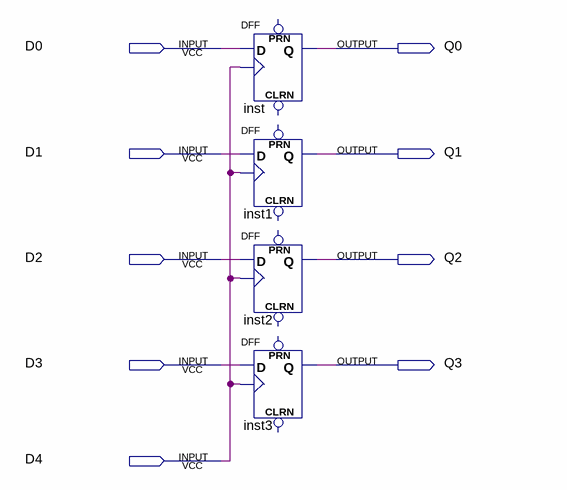
[diagram p0: schematic sheet]
// Quartus schematic scheme1.bdf as structural Verilog: 4 symbols, 9 pins
module scheme1 (
  input  D0,
  input  D1,
  input  D2,
  input  D3,
  input  D4,
  output Q0,
  output Q1,
  output Q2,
  output Q3
);

  DFF inst (.CLK(D4), .D(D0), .Q(Q0));  // open: CLRN, PRN
  DFF inst1 (.CLK(D4), .D(D1), .Q(Q1));  // open: CLRN, PRN
  DFF inst2 (.CLK(D4), .D(D2), .Q(Q2));  // open: CLRN, PRN
  DFF inst3 (.CLK(D4), .D(D3), .Q(Q3));  // open: CLRN, PRN
endmodule
